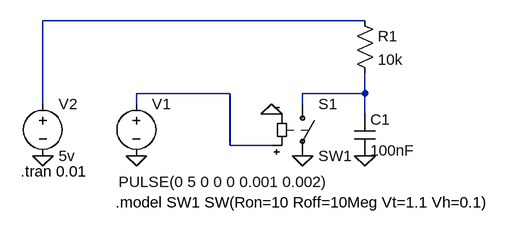
[diagram p0: schematic ButtonInput.asc]
ButtonInput.asc, the LTspice schematic file:
Version 4
SHEET 1 880 680
WIRE 240 -16 -256 -16
WIRE 32 96 -112 96
WIRE 240 96 240 64
WIRE 240 96 144 96
WIRE -256 112 -256 -16
WIRE -112 112 -112 96
WIRE 144 112 144 96
WIRE 240 128 240 96
WIRE 32 176 32 96
WIRE 96 176 32 176
FLAG 240 192 0
FLAG -256 192 0
FLAG -112 192 0
FLAG 144 192 0
FLAG 96 128 0
SYMBOL cap 224 128 R0
SYMATTR InstName C1
SYMATTR Value 100nF
SYMBOL voltage -112 96 R0
WINDOW 3 -27 136 Left 2
WINDOW 123 0 0 Left 2
WINDOW 39 0 0 Left 2
SYMATTR InstName V1
SYMATTR Value PULSE(0 5 0 0 0 0.001 0.002)
SYMBOL res 224 -32 R0
SYMATTR InstName R1
SYMATTR Value 10k
SYMBOL voltage -256 96 R0
WINDOW 123 0 0 Left 2
WINDOW 39 0 0 Left 2
SYMATTR InstName V2
SYMATTR Value 5v
SYMBOL sw 144 96 R0
SYMATTR InstName S1
SYMATTR Value SW1
TEXT -290 216 Left 2 !.tran 0.01
TEXT -144 264 Left 2 !.model SW1 SW(Ron=10 Roff=10Meg Vt=1.1 Vh=0.1)

The netlist it stands for:
* ButtonInput.asc
C1 N003 0 100nF
V1 N002 0 PULSE(0 5 0 0 0 0.001 0.002)
R1 N001 N003 10k
V2 N001 0 5v
S1 N003 0 N002 0 SW1
.tran 0.01
.model SW1 SW(Ron=10 Roff=10Meg Vt=1.1 Vh=0.1)
.backanno
.end